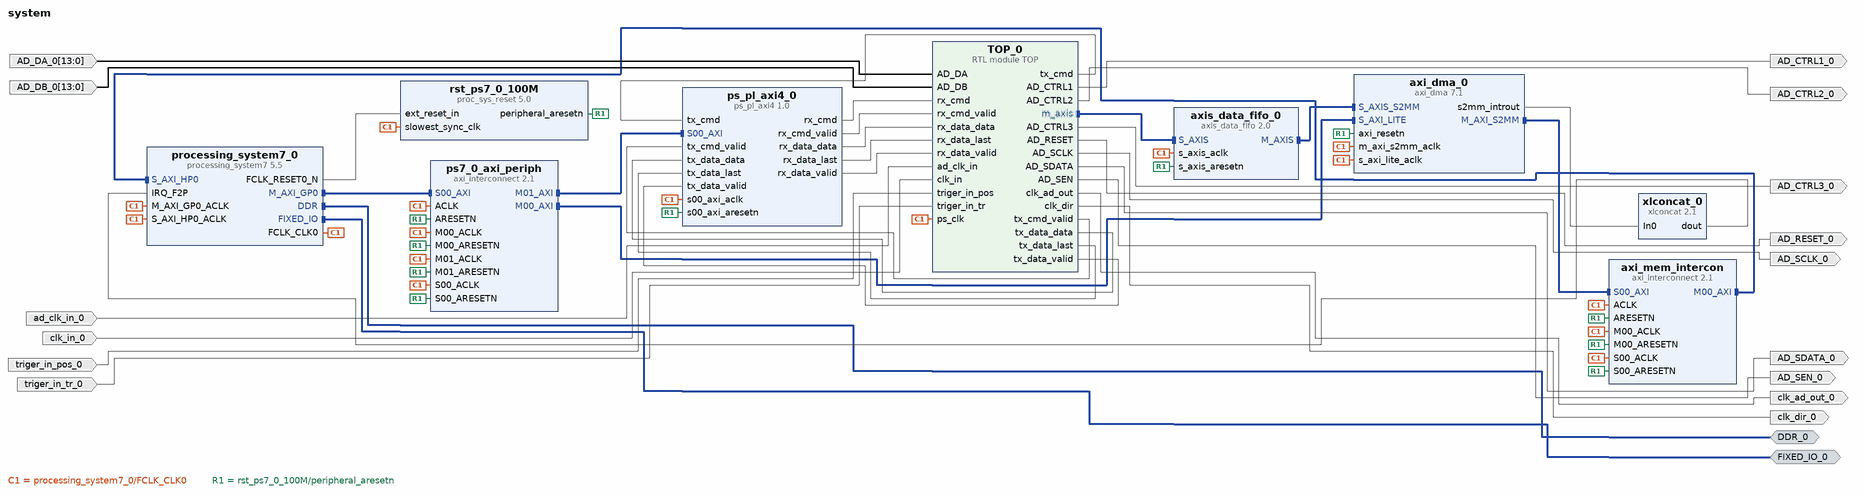
[diagram p0: block diagram of the top level]
# Vivado block design system, xc7z020clg400-2, Vivado 2021.1
create_bd_design system

create_bd_intf_port -mode Master -vlnv xilinx.com:interface:ddrx_rtl:1.0 DDR_0
create_bd_intf_port -mode Master -vlnv xilinx.com:display_processing_system7:fixedio_rtl:1.0 FIXED_IO_0
create_bd_port -dir I clk_in_0
create_bd_port -dir I triger_in_pos_0
create_bd_port -dir I triger_in_tr_0
create_bd_port -dir I ad_clk_in_0
create_bd_port -dir I -from 13 -to 0 AD_DA_0
create_bd_port -dir I -from 13 -to 0 AD_DB_0
create_bd_port -dir O clk_dir_0
create_bd_port -dir O clk_ad_out_0
create_bd_port -dir O AD_SEN_0
create_bd_port -dir O AD_SDATA_0
create_bd_port -dir O AD_SCLK_0
create_bd_port -dir O -type rst AD_RESET_0
create_bd_port -dir O AD_CTRL1_0
create_bd_port -dir O AD_CTRL2_0
create_bd_port -dir O AD_CTRL3_0

create_bd_cell -type ip -vlnv xilinx.com:ip:processing_system7:5.5 processing_system7_0
set_property -dict [list \
  CONFIG.PCW_ENET0_ENET0_IO {MIO 16 .. 27} \
  CONFIG.PCW_ENET0_GRP_MDIO_ENABLE 1 \
  CONFIG.PCW_ENET0_GRP_MDIO_IO {MIO 52 .. 53} \
  CONFIG.PCW_ENET0_PERIPHERAL_ENABLE 1 \
  CONFIG.PCW_FPGA0_PERIPHERAL_FREQMHZ 100 \
  CONFIG.PCW_IRQ_F2P_INTR 1 \
  CONFIG.PCW_PRESET_BANK1_VOLTAGE {LVCMOS 1.8V} \
  CONFIG.PCW_QSPI_GRP_SINGLE_SS_ENABLE 1 \
  CONFIG.PCW_QSPI_GRP_SINGLE_SS_IO {MIO 1 .. 6} \
  CONFIG.PCW_QSPI_PERIPHERAL_ENABLE 1 \
  CONFIG.PCW_QSPI_QSPI_IO {MIO 1 .. 6} \
  CONFIG.PCW_SD0_GRP_CD_ENABLE 0 \
  CONFIG.PCW_SD0_GRP_WP_ENABLE 0 \
  CONFIG.PCW_SD0_PERIPHERAL_ENABLE 1 \
  CONFIG.PCW_SD0_SD0_IO {MIO 40 .. 45} \
  CONFIG.PCW_SDIO_PERIPHERAL_FREQMHZ 100 \
  CONFIG.PCW_SINGLE_QSPI_DATA_MODE x4 \
  CONFIG.PCW_UART0_PERIPHERAL_ENABLE 1 \
  CONFIG.PCW_UART0_UART0_IO {MIO 14 .. 15} \
  CONFIG.PCW_UART_PERIPHERAL_FREQMHZ 100 \
  CONFIG.PCW_UIPARAM_DDR_PARTNO {MT41K256M16 RE-125} \
  CONFIG.PCW_USE_FABRIC_INTERRUPT 1 \
  CONFIG.PCW_USE_S_AXI_HP0 1 \
] [get_bd_cells processing_system7_0]
# 130 more settings of processing_system7_0 are not shown: defaults, MIO pin electricals, DDR timing, and values the tool derives
create_bd_cell -type ip -vlnv xilinx.com:ip:xlconcat:2.1 xlconcat_0
create_bd_cell -type ip -vlnv xilinx.com:ip:axi_dma:7.1 axi_dma_0
set_property -dict [list \
  CONFIG.c_include_mm2s 0 \
  CONFIG.c_include_s2mm_dre 1 \
  CONFIG.c_include_sg 0 \
  CONFIG.c_m_axi_s2mm_data_width 64 \
  CONFIG.c_s_axis_s2mm_tdata_width 16 \
  CONFIG.c_sg_length_width 24 \
] [get_bd_cells axi_dma_0]
create_bd_cell -type ip -vlnv xilinx.com:ip:proc_sys_reset:5.0 rst_ps7_0_100M
create_bd_cell -type ip -vlnv xilinx.com:user:ps_pl_axi4:1.0 ps_pl_axi4_0
create_bd_cell -type ip -vlnv xilinx.com:ip:axi_interconnect:2.1 ps7_0_axi_periph
set_property -dict {CONFIG.NUM_MI 2} [get_bd_cells ps7_0_axi_periph]
create_bd_cell -type ip -vlnv xilinx.com:ip:axi_interconnect:2.1 axi_mem_intercon
set_property -dict {CONFIG.NUM_MI 1} [get_bd_cells axi_mem_intercon]
create_bd_cell -type ip -vlnv xilinx.com:ip:axis_data_fifo:2.0 axis_data_fifo_0
create_bd_cell -type module -reference TOP TOP_0

# ---- connections ----

connect_bd_intf_net [get_bd_intf_pins axis_data_fifo_0/S_AXIS] [get_bd_intf_pins TOP_0/m_axis]
connect_bd_intf_net [get_bd_intf_pins axi_dma_0/M_AXI_S2MM] [get_bd_intf_pins axi_mem_intercon/S00_AXI]
connect_bd_intf_net [get_bd_intf_pins axi_mem_intercon/M00_AXI] [get_bd_intf_pins processing_system7_0/S_AXI_HP0]
connect_bd_intf_net [get_bd_intf_pins axis_data_fifo_0/M_AXIS] [get_bd_intf_pins axi_dma_0/S_AXIS_S2MM]
connect_bd_intf_net [get_bd_intf_ports DDR_0] [get_bd_intf_pins processing_system7_0/DDR]
connect_bd_intf_net [get_bd_intf_ports FIXED_IO_0] [get_bd_intf_pins processing_system7_0/FIXED_IO]
connect_bd_intf_net [get_bd_intf_pins processing_system7_0/M_AXI_GP0] [get_bd_intf_pins ps7_0_axi_periph/S00_AXI]
connect_bd_intf_net [get_bd_intf_pins ps7_0_axi_periph/M00_AXI] [get_bd_intf_pins axi_dma_0/S_AXI_LITE]
connect_bd_intf_net [get_bd_intf_pins ps7_0_axi_periph/M01_AXI] [get_bd_intf_pins ps_pl_axi4_0/S00_AXI]
connect_bd_net -net AD_DA_0_1 [get_bd_ports AD_DA_0] [get_bd_pins TOP_0/AD_DA]
connect_bd_net -net AD_DB_0_1 [get_bd_ports AD_DB_0] [get_bd_pins TOP_0/AD_DB]
connect_bd_net [get_bd_pins TOP_0/AD_CTRL1] [get_bd_ports AD_CTRL1_0]
connect_bd_net [get_bd_pins TOP_0/AD_CTRL2] [get_bd_ports AD_CTRL2_0]
connect_bd_net [get_bd_pins TOP_0/AD_CTRL3] [get_bd_ports AD_CTRL3_0]
connect_bd_net [get_bd_pins TOP_0/AD_RESET] [get_bd_ports AD_RESET_0]
connect_bd_net [get_bd_pins TOP_0/AD_SCLK] [get_bd_ports AD_SCLK_0]
connect_bd_net [get_bd_pins TOP_0/AD_SDATA] [get_bd_ports AD_SDATA_0]
connect_bd_net [get_bd_pins TOP_0/AD_SEN] [get_bd_ports AD_SEN_0]
connect_bd_net [get_bd_pins TOP_0/clk_ad_out] [get_bd_ports clk_ad_out_0]
connect_bd_net [get_bd_pins TOP_0/clk_dir] [get_bd_ports clk_dir_0]
connect_bd_net [get_bd_pins TOP_0/tx_cmd] [get_bd_pins ps_pl_axi4_0/tx_cmd]
connect_bd_net [get_bd_pins TOP_0/tx_cmd_valid] [get_bd_pins ps_pl_axi4_0/tx_cmd_valid]
connect_bd_net [get_bd_pins TOP_0/tx_data_data] [get_bd_pins ps_pl_axi4_0/tx_data_data]
connect_bd_net [get_bd_pins TOP_0/tx_data_last] [get_bd_pins ps_pl_axi4_0/tx_data_last]
connect_bd_net [get_bd_pins TOP_0/tx_data_valid] [get_bd_pins ps_pl_axi4_0/tx_data_valid]
connect_bd_net -net ad_clk_in_0_1 [get_bd_ports ad_clk_in_0] [get_bd_pins TOP_0/ad_clk_in]
connect_bd_net [get_bd_pins axi_dma_0/s2mm_introut] [get_bd_pins xlconcat_0/In0]
connect_bd_net -net clk_in_0_1 [get_bd_ports clk_in_0] [get_bd_pins TOP_0/clk_in]
connect_bd_net [get_bd_pins processing_system7_0/FCLK_CLK0] \
  [get_bd_pins processing_system7_0/M_AXI_GP0_ACLK] [get_bd_pins rst_ps7_0_100M/slowest_sync_clk] \
  [get_bd_pins axi_dma_0/s_axi_lite_aclk] [get_bd_pins axi_dma_0/m_axi_s2mm_aclk] \
  [get_bd_pins processing_system7_0/S_AXI_HP0_ACLK] [get_bd_pins ps_pl_axi4_0/s00_axi_aclk] \
  [get_bd_pins ps7_0_axi_periph/ACLK] [get_bd_pins ps7_0_axi_periph/S00_ACLK] [get_bd_pins ps7_0_axi_periph/M00_ACLK] \
  [get_bd_pins axi_mem_intercon/ACLK] [get_bd_pins axi_mem_intercon/S00_ACLK] [get_bd_pins axi_mem_intercon/M00_ACLK] \
  [get_bd_pins ps7_0_axi_periph/M01_ACLK] [get_bd_pins axis_data_fifo_0/s_axis_aclk] [get_bd_pins TOP_0/ps_clk]
connect_bd_net [get_bd_pins processing_system7_0/FCLK_RESET0_N] [get_bd_pins rst_ps7_0_100M/ext_reset_in]
connect_bd_net [get_bd_pins ps_pl_axi4_0/rx_cmd] [get_bd_pins TOP_0/rx_cmd]
connect_bd_net [get_bd_pins ps_pl_axi4_0/rx_cmd_valid] [get_bd_pins TOP_0/rx_cmd_valid]
connect_bd_net [get_bd_pins ps_pl_axi4_0/rx_data_data] [get_bd_pins TOP_0/rx_data_data]
connect_bd_net [get_bd_pins ps_pl_axi4_0/rx_data_last] [get_bd_pins TOP_0/rx_data_last]
connect_bd_net [get_bd_pins ps_pl_axi4_0/rx_data_valid] [get_bd_pins TOP_0/rx_data_valid]
connect_bd_net [get_bd_pins rst_ps7_0_100M/peripheral_aresetn] \
  [get_bd_pins axi_dma_0/axi_resetn] [get_bd_pins ps_pl_axi4_0/s00_axi_aresetn] [get_bd_pins ps7_0_axi_periph/S00_ARESETN] \
  [get_bd_pins ps7_0_axi_periph/M00_ARESETN] [get_bd_pins ps7_0_axi_periph/ARESETN] \
  [get_bd_pins axi_mem_intercon/S00_ARESETN] [get_bd_pins axi_mem_intercon/M00_ARESETN] \
  [get_bd_pins axi_mem_intercon/ARESETN] [get_bd_pins ps7_0_axi_periph/M01_ARESETN] \
  [get_bd_pins axis_data_fifo_0/s_axis_aresetn]
connect_bd_net -net triger_in_pos_0_1 [get_bd_ports triger_in_pos_0] [get_bd_pins TOP_0/triger_in_pos]
connect_bd_net -net triger_in_tr_0_1 [get_bd_ports triger_in_tr_0] [get_bd_pins TOP_0/triger_in_tr]
connect_bd_net [get_bd_pins xlconcat_0/dout] [get_bd_pins processing_system7_0/IRQ_F2P]

# ---- address map ----
assign_bd_address -offset 0x00000000 -range 1G -target_address_space [get_bd_addr_spaces axi_dma_0/Data_S2MM] [get_bd_addr_segs processing_system7_0/S_AXI_HP0/HP0_DDR_LOWOCM]
exclude_bd_addr_seg -offset 0x40400000 -range 64K -target_address_space [get_bd_addr_spaces axi_dma_0/Data_S2MM] [get_bd_addr_segs axi_dma_0/S_AXI_LITE/Reg]
exclude_bd_addr_seg -offset 0x43C00000 -range 64K -target_address_space [get_bd_addr_spaces axi_dma_0/Data_S2MM] [get_bd_addr_segs ps_pl_axi4_0/S00_AXI/S00_AXI_reg]
assign_bd_address -offset 0x40400000 -range 64K -target_address_space [get_bd_addr_spaces processing_system7_0/Data] [get_bd_addr_segs axi_dma_0/S_AXI_LITE/Reg]
assign_bd_address -offset 0x43C00000 -range 64K -target_address_space [get_bd_addr_spaces processing_system7_0/Data] [get_bd_addr_segs ps_pl_axi4_0/S00_AXI/S00_AXI_reg]
exclude_bd_addr_seg -offset 0x00000000 -range 1 -target_address_space [get_bd_addr_spaces processing_system7_0/Data] [get_bd_addr_segs processing_system7_0/S_AXI_HP0/HP0_DDR_LOWOCM]
exclude_bd_addr_seg -offset 0x00000000 -range 1 -target_address_space [get_bd_addr_spaces processing_system7_0/Data] [get_bd_addr_segs processing_system7_0/S_AXI_HP0/HP0_DDR_LOWOCM]

validate_bd_design
save_bd_design
